# EAGLE schematic charivari (EAGLE 7.6.0)
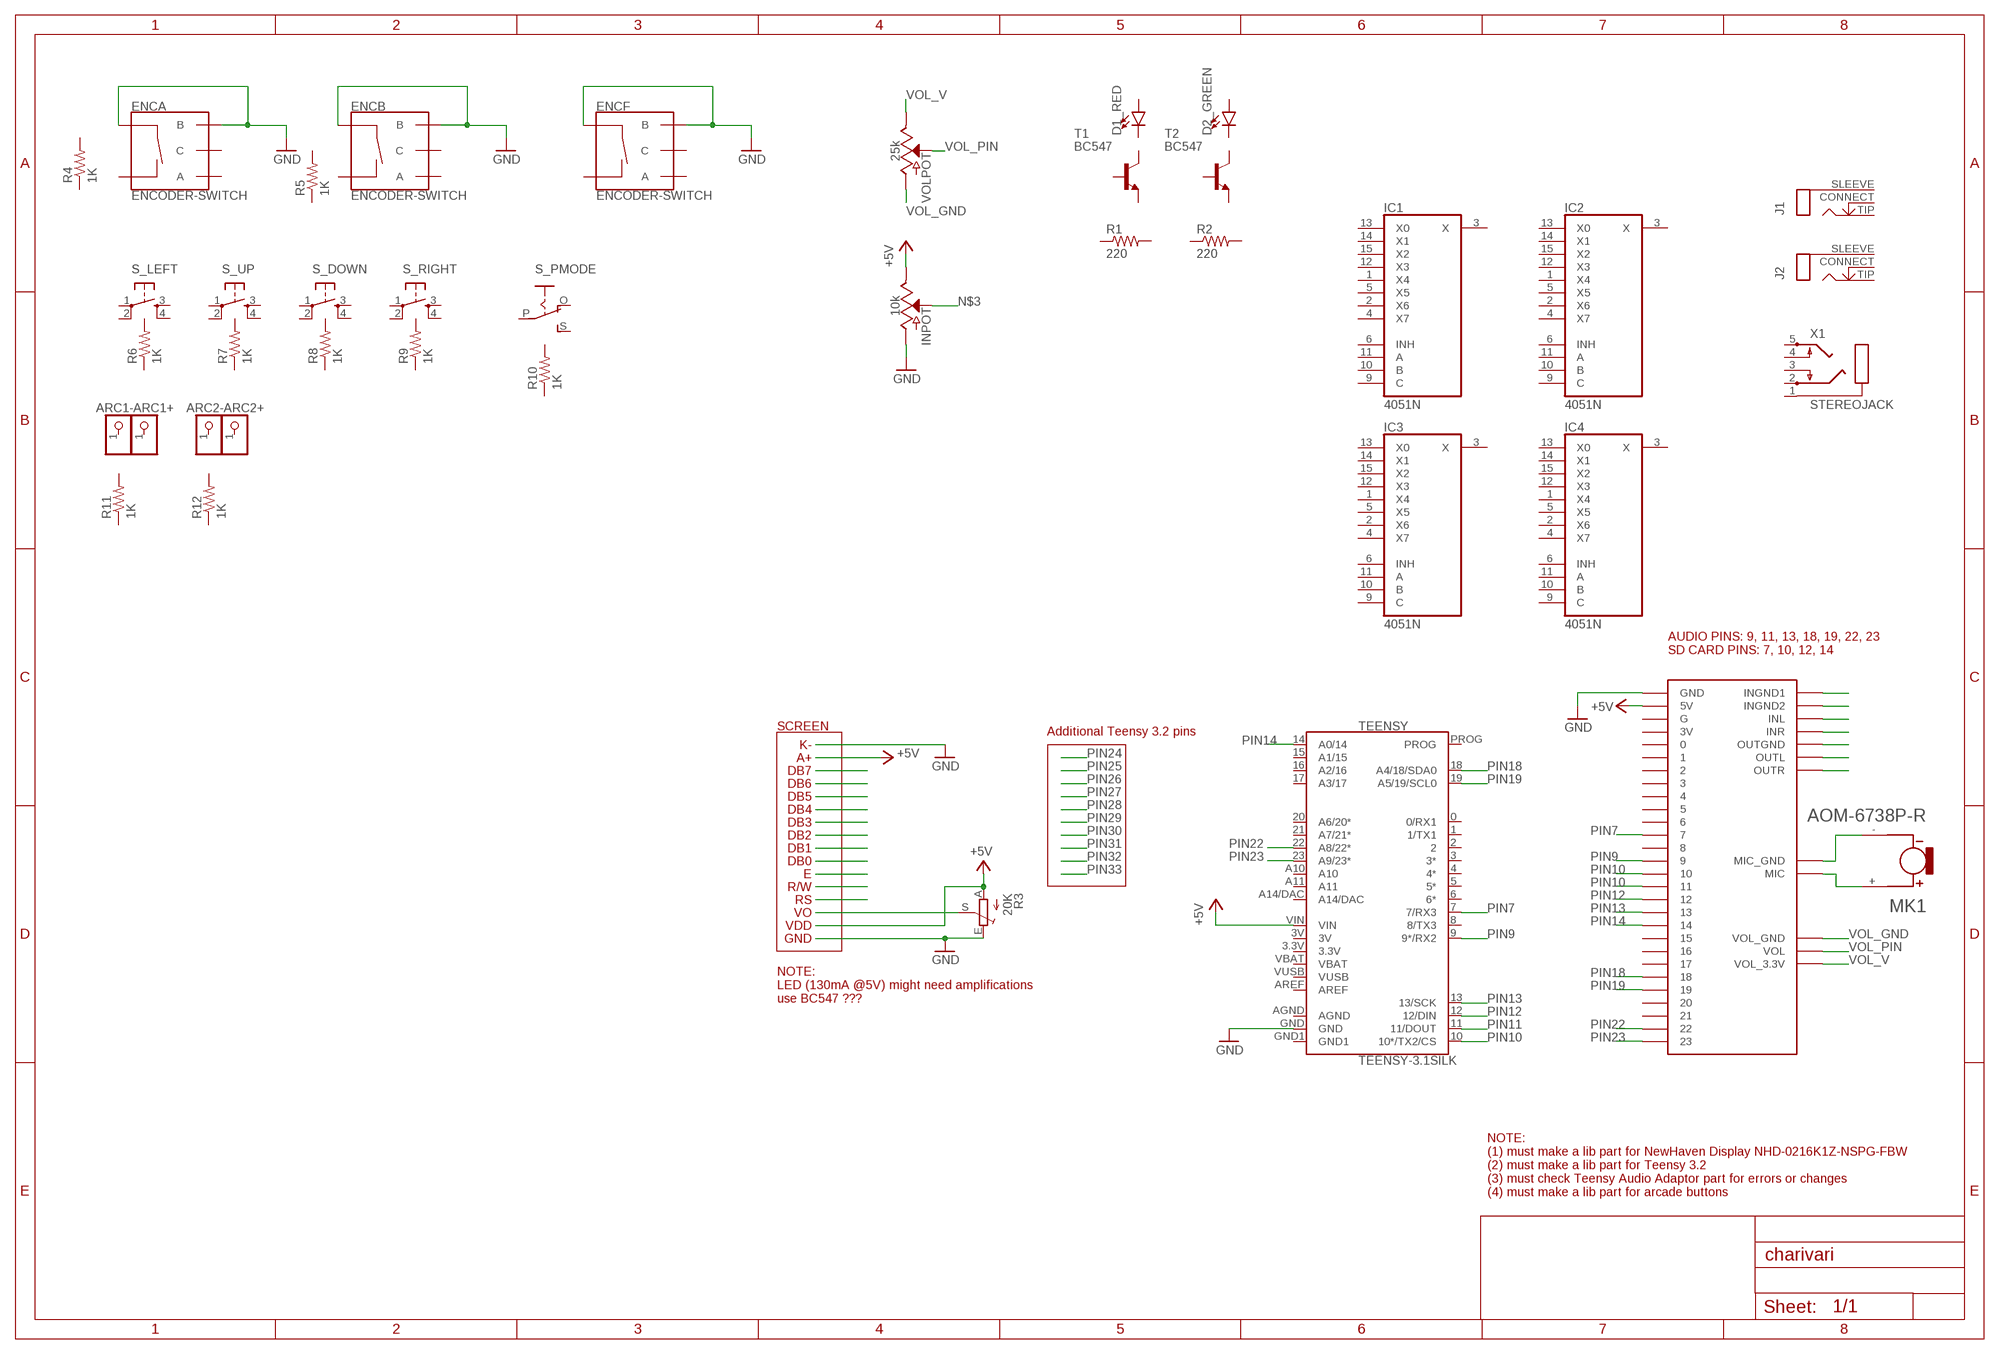
[diagram p0: schematic, sheet 1]

## Parts
ARC1+  PINHD-1X1  [1X01]
ARC1-  PINHD-1X1  [1X01]
ARC2+  PINHD-1X1  [1X01]
ARC2-  PINHD-1X1  [1X01]
AUDIO_ADAPTOR  AUDIOSHIELD  [AUDIOSHIELD]
D1_RED  LED5MM  [LED_5MM]
D2_GREEN  LED5MM  [LED_5MM]
ENCA  ENCODER-SWITCH  [ROTARY_ENC_PLAIN]
ENCB  ENCODER-SWITCH  [ROTARY_ENC_PLAIN]
ENCF  ENCODER-SWITCH  [ROTARY_ENC_PLAIN]
IC1  4051N  [DIL16]
IC2  4051N  [DIL16]
IC3  4051N  [DIL16]
IC4  4051N  [DIL16]
INPOT  10k  POTENTIOMETER-PTH-9MM-1/20W-20%-KIT  [POT-PTH-ALPS-KIT]
J1  CLOSEDMONO  [CLOSED_MONO_JACK]
J2  CLOSEDMONO  [CLOSED_MONO_JACK]
MK1  AOM-6738P-R  [MIC_AOM-6738P-R]
R1  220  R-US_0204/7  [0204/7]
R2  220  R-US_0204/7  [0204/7]
R3  20K  TRIM_EU-B25P  [B25P]
R4  1K  R-US_0204/7  [0204/7]
R5  1K  R-US_0204/7  [0204/7]
R6  1K  R-US_0204/7  [0204/7]
R7  1K  R-US_0204/7  [0204/7]
R8  1K  R-US_0204/7  [0204/7]
R9  1K  R-US_0204/7  [0204/7]
R10  1K  R-US_0204/7  [0204/7]
R11  1K  R-US_0204/7  [0204/7]
R12  1K  R-US_0204/7  [0204/7]
S_DOWN  TAC_SWITCHPTH  [TACTILE-PTH]
S_LEFT  TAC_SWITCHPTH  [TACTILE-PTH]
S_PMODE  EG1218S  [EG1218]
S_RIGHT  TAC_SWITCHPTH  [TACTILE-PTH]
S_UP  TAC_SWITCHPTH  [TACTILE-PTH]
T1  BC547  [TO92]
T2  BC547  [TO92]
TEENSY  TEENSY-3.1SILK  [TEENSY-3.1]
VOLPOT  25k  POTENTIOMETER-PTH-9MM-1/20W-20%-KIT  [POT-PTH-ALPS-KIT]
X1  STEREOJACK  [STX3100]

## Nets
+5V: AUDIO_ADAPTOR.5V INPOT.P$1(E) R3.A TEENSY.VIN
GND: AUDIO_ADAPTOR.GND ENCA.B ENCA.SW+ ENCB.B ENCB.SW+ ENCF.B ENCF.SW+ INPOT.P$3(A) R3.E TEENSY.GND
N$1: AUDIO_ADAPTOR.GND_MIC(MIC_GND) MK1.-
N$2: AUDIO_ADAPTOR.MIC MK1.+
N$3: INPOT.P$2(S)
N$5: AUDIO_ADAPTOR.OUTGND
N$6: AUDIO_ADAPTOR.OUTL
N$7: AUDIO_ADAPTOR.OUTR
N$8: AUDIO_ADAPTOR.INGND1
N$9: AUDIO_ADAPTOR.INGND2
N$10: AUDIO_ADAPTOR.INL
N$11: AUDIO_ADAPTOR.INR
N$24: R3.S
PIN7: AUDIO_ADAPTOR.7 TEENSY.7(7/RX3)
PIN9: AUDIO_ADAPTOR.9 TEENSY.9(9*/RX2)
PIN10: AUDIO_ADAPTOR.10 AUDIO_ADAPTOR.11 TEENSY.10(10*/TX2/CS)
PIN11: TEENSY.11(11/DOUT)
PIN12: AUDIO_ADAPTOR.12 TEENSY.12(12/DIN)
PIN13: AUDIO_ADAPTOR.13 TEENSY.13(13/SCK)
PIN14: AUDIO_ADAPTOR.14 TEENSY.14(A0/14)
PIN18: AUDIO_ADAPTOR.18 TEENSY.18(A4/18/SDA0)
PIN19: AUDIO_ADAPTOR.19 TEENSY.19(A5/19/SCL0)
PIN22: AUDIO_ADAPTOR.22 TEENSY.22(A8/22*)
PIN23: AUDIO_ADAPTOR.23 TEENSY.23(A9/23*)
VOL_GND: AUDIO_ADAPTOR.VOL_GND VOLPOT.P$3(A)
VOL_PIN: AUDIO_ADAPTOR.VOL VOLPOT.P$2(S)
VOL_V: AUDIO_ADAPTOR.VOL_3.3V VOLPOT.P$1(E)
Unconnected: ARC1+.1 ARC1-.1 ARC2+.1 ARC2-.1 AUDIO_ADAPTOR.0 AUDIO_ADAPTOR.1 AUDIO_ADAPTOR.2 AUDIO_ADAPTOR.3 AUDIO_ADAPTOR.3V AUDIO_ADAPTOR.4 AUDIO_ADAPTOR.5 AUDIO_ADAPTOR.6 AUDIO_ADAPTOR.8 AUDIO_ADAPTOR.15 AUDIO_ADAPTOR.16 AUDIO_ADAPTOR.17 AUDIO_ADAPTOR.20 AUDIO_ADAPTOR.21 AUDIO_ADAPTOR.G D1_RED.A D1_RED.K(C) D2_GREEN.A D2_GREEN.K(C) ENCA.A ENCA.C ENCA.SW- ENCB.A ENCB.C ENCB.SW- ENCF.A ENCF.C ENCF.SW- IC1.1(X4) IC1.2(X6) IC1.3(X) IC1.4(X7) IC1.5(X5) IC1.6(INH) IC1.9(C) IC1.10(B) IC1.11(A) IC1.12(X3) IC1.13(X0) IC1.14(X1) IC1.15(X2) IC2.1(X4) IC2.2(X6) IC2.3(X) IC2.4(X7) IC2.5(X5) IC2.6(INH) IC2.9(C) IC2.10(B) IC2.11(A) IC2.12(X3) IC2.13(X0) IC2.14(X1) IC2.15(X2) IC3.1(X4) IC3.2(X6) IC3.3(X) IC3.4(X7) IC3.5(X5) IC3.6(INH) IC3.9(C) IC3.10(B) IC3.11(A) IC3.12(X3) IC3.13(X0) IC3.14(X1) IC3.15(X2) IC4.1(X4) IC4.2(X6) IC4.3(X) IC4.4(X7) IC4.5(X5) IC4.6(INH) IC4.9(C) IC4.10(B) IC4.11(A) IC4.12(X3) IC4.13(X0) IC4.14(X1) IC4.15(X2) J1.CONNECT J1.SLEEVE(RING) J1.TIP J2.CONNECT J2.SLEEVE(RING) J2.TIP R1.1 R1.2 R2.1 R2.2 R4.1 R4.2 R5.1 R5.2 R6.1 R6.2 R7.1 R7.2 R8.1 R8.2 R9.1 R9.2 R10.1 R10.2 R11.1 R11.2 R12.1 R12.2 S_DOWN.1 S_DOWN.2 S_DOWN.3 S_DOWN.4 S_LEFT.1 S_LEFT.2 S_LEFT.3 S_LEFT.4 S_PMODE.O S_PMODE.P S_PMODE.S S_RIGHT.1 S_RIGHT.2 S_RIGHT.3 S_RIGHT.4 S_UP.1 S_UP.2 S_UP.3 S_UP.4 T1.1(E) T1.2(B) T1.3(C) T2.1(E) T2.2(B) T2.3(C) TEENSY.0(0/RX1) TEENSY.1(1/TX1) TEENSY.2 TEENSY.3(3*) TEENSY.4(4*) TEENSY.5(5*) TEENSY.6(6*) TEENSY.8(8/TX3) TEENSY.15(A1/15) TEENSY.16(A2/16) TEENSY.17(A3/17) TEENSY.20(A6/20*) TEENSY.21(A7/21*) TEENSY.A10 TEENSY.A11 TEENSY.A14/DAC TEENSY.AREF TEENSY.PROG X1.1 X1.2 X1.3 X1.4 X1.5

## Notes on the sheet
- AUDIO PINS: 9, 11, 13, 18, 19, 22, 23
  SD CARD PINS: 7, 10, 12, 14
- SCREEN
- Additional Teensy 3.2 pins
- K-
- A+
- DB7
- DB6
- DB5
- DB4
- DB3
- DB2
- DB1
- DB0
- E
- R/W
- RS
- VO
- VDD
- GND
- NOTE: 
  LED (130mA @5V) might need amplifications 
  use BC547 ???
- NOTE:
  (1) must make a lib part for NewHaven Display NHD-0216K1Z-NSPG-FBW
  (2) must make a lib part for Teensy 3.2
  (3) must check Teensy Audio Adaptor part for errors or changes 
  (4) must make a lib part for arcade buttons

## Power pins joined to a net without a drawn wire
3.3V: TEENSY.3.3V
3V: TEENSY.3V
AGND: TEENSY.AGND
GND: IC1.8(GND) IC2.8(GND) IC3.8(GND) IC4.8(GND)
GND1: TEENSY.GND1
VBAT: TEENSY.VBAT
VCC: IC1.16(VCC) IC2.16(VCC) IC3.16(VCC) IC4.16(VCC)
VEE: IC1.7(VEE) IC2.7(VEE) IC3.7(VEE) IC4.7(VEE)
VUSB: TEENSY.VUSB

## Library data of the parts
ARC1+ ARC1- ARC2+ ARC2- = adafruit:PINHD-1X1: Pin header 1x1 for 0.1" spacing With round pins
AUDIO_ADAPTOR = Teensy_Audioshield:AUDIOSHIELD: Teensy 3 Audioshield by PJRC.COM
D1_RED D2_GREEN = SparkFun-LED:LED: LED (Generic) Standard schematic elements and footprints for 5mm, 3mm, 1206, and 0603 sized LEDs. Generic LEDs with no color specified.
ENCA ENCB ENCF = SparkFun-Switches:ENCODER-SWITCH: Rotary Encoder w/ Select Switch Encoders rotate similarly to potentiometers, but they’re different from potentiometers in that an encoder has full rotation without limits. They output gray code so that you can tell how much and in which direction the encoder has been turned. This encoder includes a push-down select switch built into the shaft. SparkFun Products Rotary Encoder <https://www.sparkfun.com/products/9117> (COM-09117); SF_SKU: COM-09117
IC1-IC4 = 40xx:4051: 8-channel ANALOG MULTIPLEXER
INPOT = SparkFun-Resistors:POTENTIOMETER: Potentiometer (Pot) Three-terminal potentiometers, with an adjustable wiper and two adjustable resistors. A pot can be used to create a configurable voltage divider, or as a variable resistor. Variants ALPS_POT and ALPS_POT_KIT - PTH, breadboard compatible, 9mm square pots Rotary Potentiometer - Linear (10k ohm) <https://www.sparkfun.com/products/9288> (COM-09288) The KIT variant exposes copper on only one side of the PTH pad, so the part can only be assembled on one side of the PCB. Useful for beginner soldering kits.; PROD_ID: RES-09177; SF_SKU: COM-09288
J1 J2 = gm-jacks:CLOSEDMONO: Closed Mono 1/4" Phone Jack
MK1 = AOM-6738P-R:AOM-6738P-R: Microphone -46db 1.5vdc .5ma 2.2kohm; AVAILABILITY: Unavailable; DESCRIPTION: Microphone -46db 1.5vdc .5ma 2.2kohm; MF: PUI; MP: AOM-6738P-R; PACKAGE: PUI; PRICE: None
R1 R2 R4-R12 = rcl:R-US_: RESISTOR, American symbol
R3 = pot:TRIM_EU-: POTENTIOMETER
S_DOWN S_LEFT S_RIGHT S_UP = SparkFun-Retired:TAC_SWITCH: Momentary Switch Button commonly used for reset or general input. Spark Fun Electronics SKU : COM-00097 SMT- SWCH-08247
S_PMODE = adafruit:EG1218: SLIDING SWITCH 0.1" spacing through hole, vertical SPDT slide switch http://www.ladyada.net/library/pcb/eaglelibrary.html
T1 T2 = transistor:BC547: NPN TRANSISTOR
TEENSY = SparkFun-Boards:TEENSY-3.1: Teensy 3+ Footprint Mechanical footprint with connectors for Teensy Development Board with ARM Cortex. SparkFun Products: Teensy 3.2 <https://www.sparkfun.com/products/13736> Teensy LC <https://www.sparkfun.com/products/13305>; SF_ID: DEV-12646
VOLPOT = SparkFun-Resistors:POTENTIOMETER: Potentiometer (Pot) Three-terminal potentiometers, with an adjustable wiper and two adjustable resistors. A pot can be used to create a configurable voltage divider, or as a variable resistor. Variants ALPS_POT and ALPS_POT_KIT - PTH, breadboard compatible, 9mm square pots Rotary Potentiometer - Linear (10k ohm) <https://www.sparkfun.com/products/9288> (COM-09288) The KIT variant exposes copper on only one side of the PTH pad, so the part can only be assembled on one side of the PCB. Useful for beginner soldering kits.; PROD_ID: RES-09177; SF_SKU: COM-09288; VALUE: 10k
X1 = adafruit:STEREOJACK: MIC/HEADPHONE JACK Stereo jack with two switches. Kycon STX3100, CUI SJ1-3555NG and/or 4UCon 05544